# EAGLE design mqtt doorbell v1.2 (EAGLE 7.6.0)
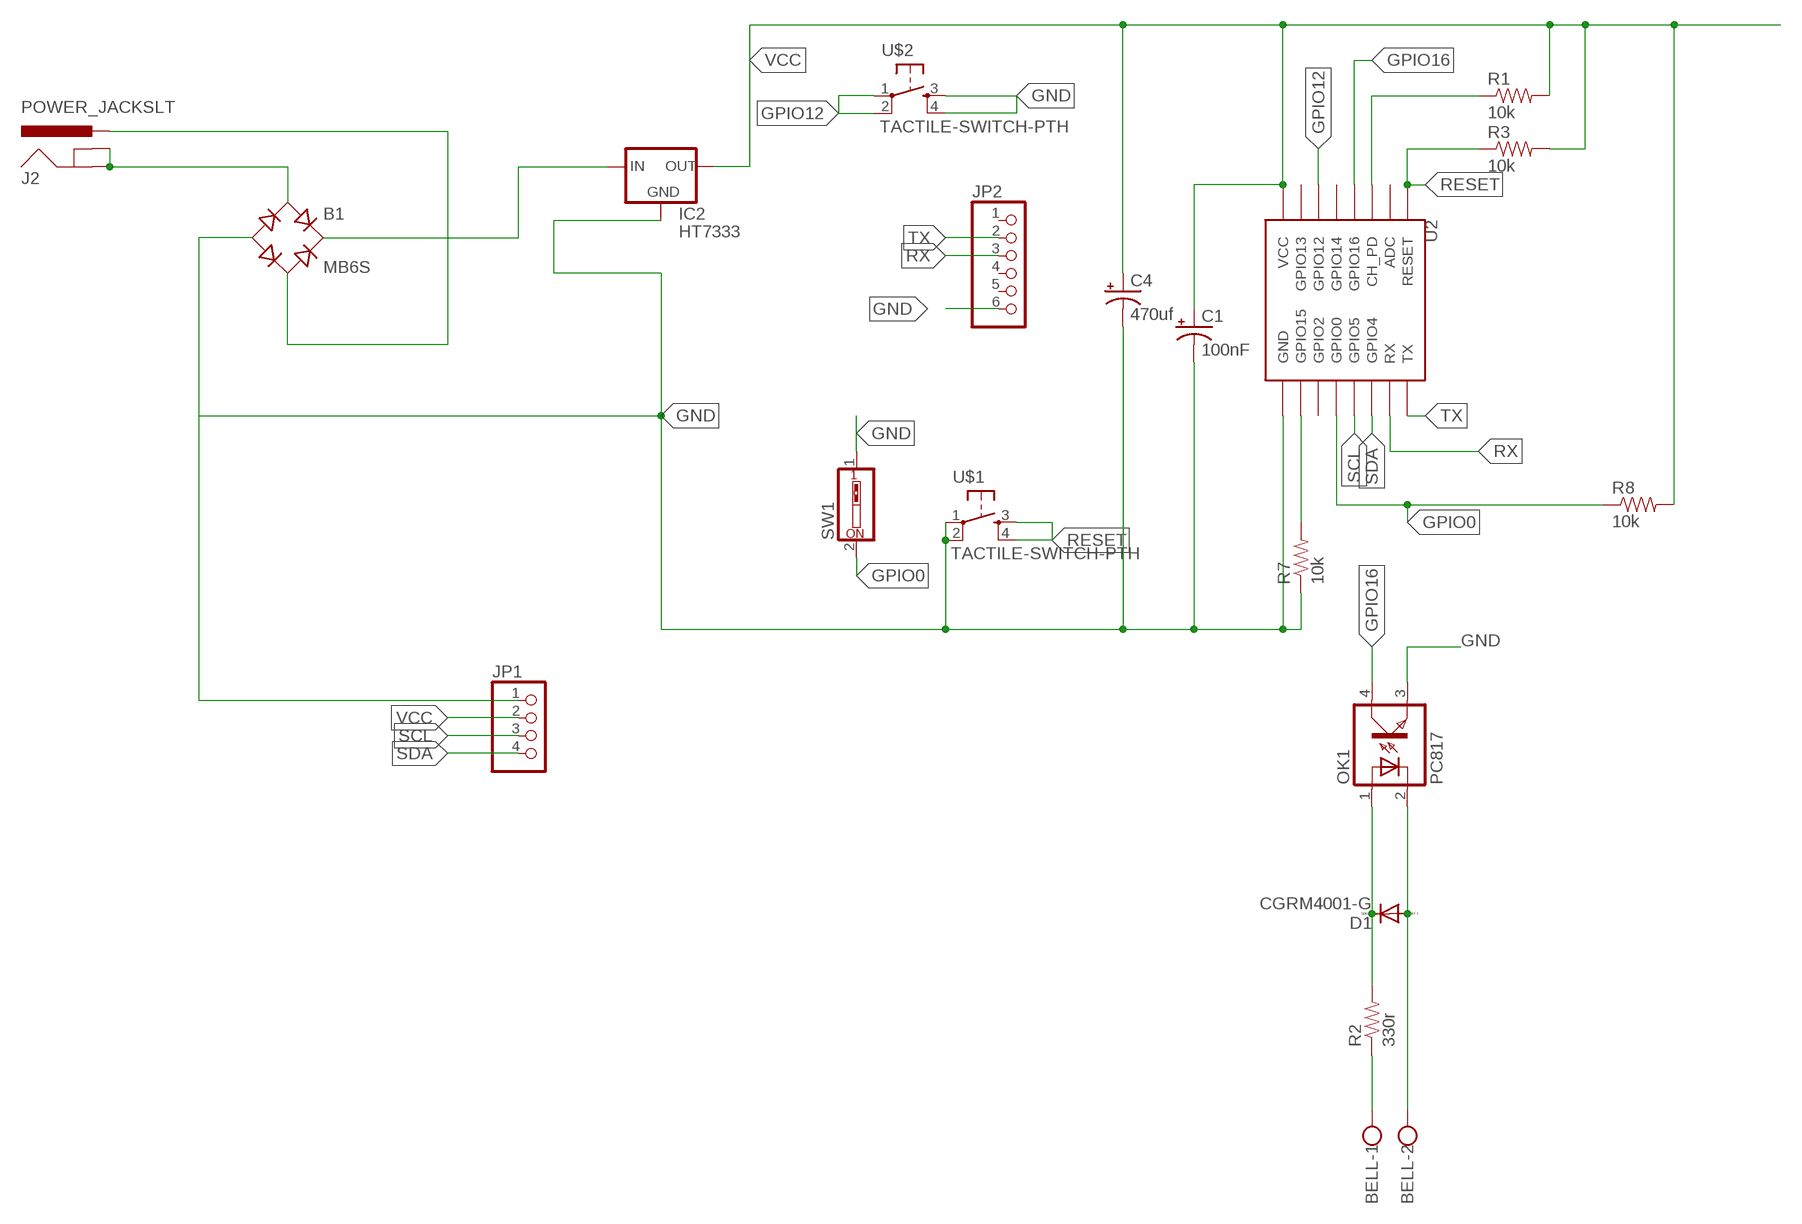
[diagram p0: schematic, sheet 1]

## Parts
B1  MB6S  MB4S  [SOIC-4]
BELL  W237-102  [W237-102]
C1  100nF  10UF-16V-10%(TANT)  [EIA3216]
C4  470uf  47UF-50V-20%(ELECT)  [PANASONIC_D]
D1  CGRM4001-G  [SOD-123_MINI-SMA]
IC2  HT7333  [SOT-89]
J2  POWER_JACKSLT  [POWER_JACK_SLOT]
JP1  PINHD-1X4  [1X04]
JP2  PINHD-1X6  [1X06]
OK1  PC817  [DIL04]
R1  10k  RESISTOR1206  [1206]
R2  330r  RESISTOR1206  [1206]
R3  10k  RESISTOR1206  [1206]
R7  10k  RESISTOR1206  [1206]
R8  10k  RESISTOR1206  [1206]
SW1  SW_DIP-1  [EDG-01]
U2  ESP12SMD  [ESP12-SMD]
U$1  TACTILE-SWITCH-PTH  [TAC-SWITCH-PTH]
U$2  TACTILE-SWITCH-PTH  [TAC-SWITCH-PTH]

## Nets
GND: B1.- C1.C(-) C4.- IC2.2(GND) JP1.1 JP2.6 OK1.3(EMIT) R7.1 SW1.1 U2.GND U$1.1 U$1.2 U$2.3 U$2.4
GPIO0: R8.1 SW1.2 U2.GPIO0
GPIO12: U2.GPIO12 U$2.1 U$2.2
GPIO16: OK1.4(COL) U2.GPIO16
N$1: B1.~2(AC2) J2.PWR
N$3: D1.C OK1.1(A) R2.2
N$4: BELL.2 D1.A OK1.2(C)
N$5: R1.1 U2.CH_PD
N$6: BELL.1 R2.1
N$7: R7.2 U2.GPIO15
N$9: B1.~1(AC1) J2.GND@1(GNDBREAK) J2.GND@2(GND)
N$10: B1.+ IC2.3(IN) IC2.4(IN)
RESET: R3.1 U2.RESET U$1.3 U$1.4
RX: JP2.3 U2.RXD0(RX)
SCL: JP1.3 U2.GPIO5
SDA: JP1.4 U2.GPIO4
TX: JP2.2 U2.TXD0(TX)
VCC: C1.A(+) C4.+ IC2.1(OUT) JP1.2 R1.2 R3.2 R8.2 U2.VCC
Unconnected: JP2.1 JP2.4 JP2.5 U2.ADC U2.GPIO2 U2.GPIO13 U2.GPIO14

## Library data of the parts
B1 = rectifier:MB*S: Bridge Rectifier Source: http://www.fairchildsemi.com/ds/MB/MB6S.pdf
BELL = con-wago-500:W237-102: WAGO SCREW CLAMP; MPN: 237-102; OC_FARNELL: unknown; OC_NEWARK: 70K9898
C1 = SparkFun-Capacitors:10UF-16V-10%(TANT): CAP-00811 1206/EIA-3216 Tantalum capacitor; PROD_ID: CAP-00811; VALUE: 10uF
C4 = SparkFun-Capacitors:47UF-50V-20%(ELECT): CAP-10547; PROD_ID: CAP-10547
D1 = diode:CGRM400*-G: Molded plasitc,JEDEC SOD-123/Mini SMA Source: Comchip CGRM4001-G.pdf
IC2 = Lemcke solutions:HT73*
J2 = Lemcke solutions:POWER_JACK: Power Jack Connector This is the standard 5.5mm barrel jack for power. The PTH is the most common, proven, reliable, footprint. The Slot footprint only works if the mill layer is transmitted to the PCB fab house so be warned. Here are the connectors we sell at SparkFun: DC Barrel Power Jack/Connector <https://www.sparkfun.com/products/119> (PRT-00119) DC Barrel Power Jack/Connector (SMD) <https://www.sparkfun.com/products/12748> (PRT-12748) DC Barrel Jack Adapter - Breadboard Compatible <https://www.sparkfun.com/products/10811> (PRT-10811) It is used on this SparkFun product (and many, many others): SparkFun RedBoard - Programmed with Arduino <https://www.sparkfun.com/products/12757> (DEV-12757) Also, if you need a mating power supply or connector, please check these out: Wall Adapter Power Supply - 9VDC 650mA <https://www.sparkfun.com/products/298> (TOL-00298) DC Barrel Jack Adapter - Male <https://www.sparkfun.com/products/10287> (PRT-10287); PROD_ID: PRT-00119
JP1 = pinhead:PINHD-1X4: PIN HEADER
JP2 = pinhead:PINHD-1X6: PIN HEADER
OK1 = optocoupler:PC817: SHARP OPTO COUPLER; MPN: PC817X4J000F; OC_FARNELL: 9707727; OC_NEWARK: 97K7059
R1-R3 R7 R8 = SparkFun-Passives:RESISTOR: Resistor Basic schematic elements and footprints for 0603, 1206, and PTH resistors.
SW1 = special:SW_DIP-1: DIP SWITCH
U2 = esp8266modules:ESP12: ESP8266 Wifi module 12
U$1 U$2 = GeekAmmo:TACTILE-SWITCH: Tactile Switch 4 Pins, SPST NO

## Net classes
0 default: width 0.203 mm, clearance 0.205 mm

## Board
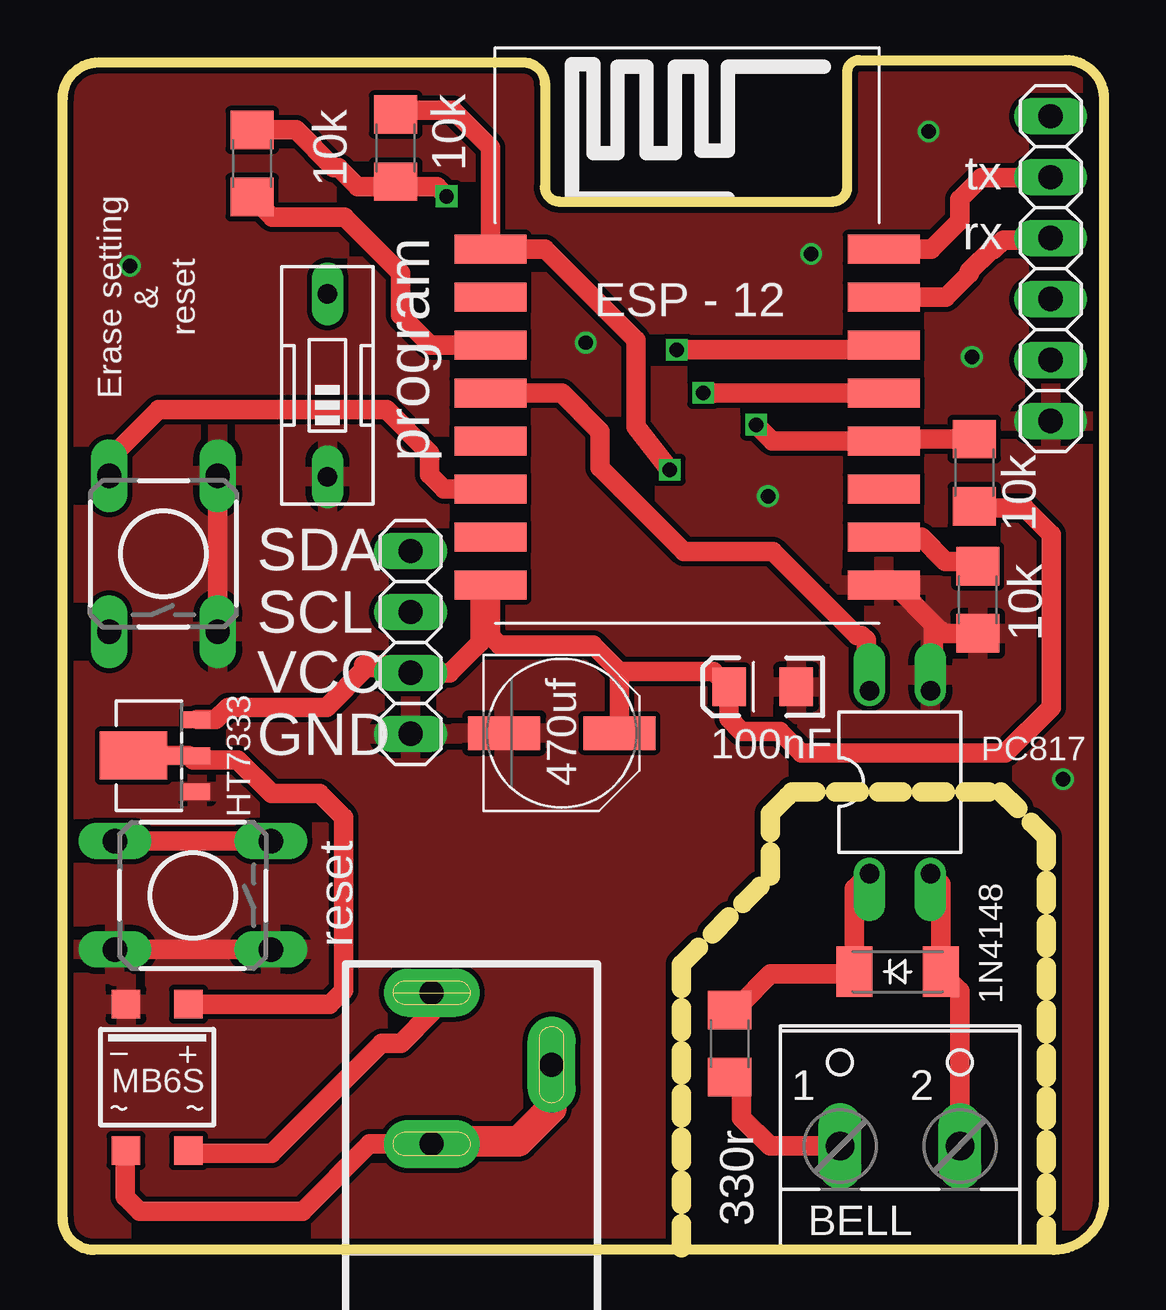
[diagram p1: board, top side]
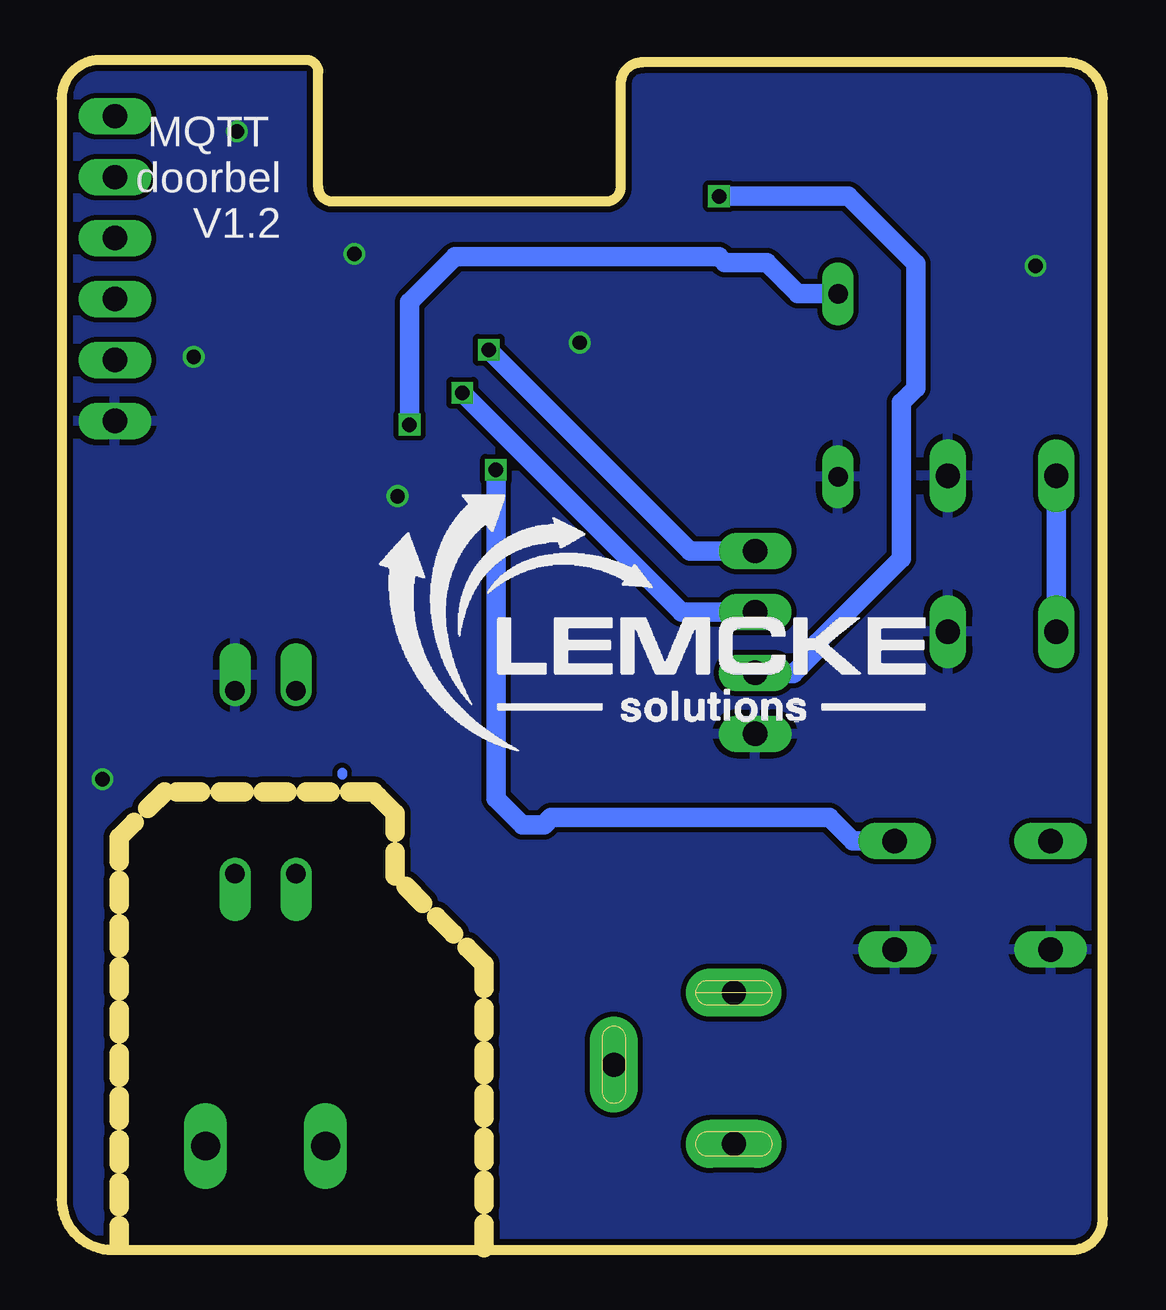
[diagram p2: board, bottom side, seen from below]

Size 43.4 x 49.6 mm. Coordinates in mm from the lower left corner, seen from the top.
Outline: 25.8,0.1 25.8,11.9 29.5,15.6 29.5,18.2 30.4,19.1 39.1,19.1 41,17.2 41,0.3
Outline: 1.5,49.5 arc90 0,48 0,1.3 arc90 1.3,0 41.3,0 arc90 43.4,2.1 43.4,48 arc90 41.8,49.6 33.2,49.6 arc90 32.7,49.1 32.7,44.3 arc-90 32.1,43.7 20.7,43.7 arc-90 20.1,44.3 20.1,48.6 arc90 19.2,49.5
Outline: 1.5,49.5 19.2,49.5
Outline: 1.5,49.5 19.2,49.5
Outline: 1.5,49.5 19.2,49.5
Copper layers (1*16): Top 0.035mm / dielectric 1.5mm / Bottom 0.035mm
Design rules "SeeedStudio_2layer_DRU_no_angle_20140221": minimum track width 6mil, minimum drill 12mil, track to track 6mil, track to pad 6mil, pad to pad 6mil, via to via 6mil, smd to smd 0mil, copper to edge 10mil, drill to drill 10mil, minimum pad ring 10mil, minimum via ring 6mil, stop-mask expansion 2mil, vias tented up to drill 100mil, thermal gap 10mil

### Footprints (pad centres in the part's own frame; a part is rotated, then mirrored left to right if it is on the bottom)
SOIC-4 = smd 1.2 x 1.2: + 1.3,3.05; - -1.3,3.05; ~1 -1.3,-3.05; ~2 1.3,-3.05
W237-102 = drill 1.194 long: 1 -2.5,-1.27; 2 2.5,-1.27
EIA3216 = smd 1.4 x 1.6: A 1.4,0; C -1.4,0
PANASONIC_D = smd 3 x 1.4: + 2.4,0; - -2.4,0
SOD-123_MINI-SMA = smd 1.5 x 2.1: A 1.8,0; C -1.8,0
SOT-89 = smd 0.7 x 1.1: 1 1.5,-2.385; 2 -1.5,-2.385 | smd 0.7 x 1.8: 3 0,-2.035 | smd 2 x 2.8: 4 0,0.265 | smd 0.635 x 1.27: P$1 0,-2.3; P$2 0,-1.6; P$3 0,-0.8; P$4 0,-0.2; P$5 0,0.3; P$6 -0.1,0.9
POWER_JACK_SLOT = drill 1 pad 2 long: GND@1 2.58,7.5; GND@2 7.58,10.8; PWR 2.58,13.8
1X04 = drill 1.016 long: 1 -3.81,0; 2 -1.27,0; 3 1.27,0; 4 3.81,0
1X06 = drill 1.016 long: 1 -6.35,0; 2 -3.81,0; 3 -1.27,0; 4 1.27,0; 5 3.81,0; 6 6.35,0
DIL04 = drill 0.813 offset: 1 -1.27,-3.81; 2 1.27,-3.81; 3 1.27,3.81; 4 -1.27,3.81
1206 = smd 1.6 x 1.8: 1 -1.4,0; 2 1.4,0
EDG-01 = drill 0.813 long: 1 0,-3.81; 2 0,3.81
ESP12-SMD = smd 3 x 1.2: ADC -8.3,3.8; CH_PD -8.3,1.8; GND 8.1,-8.2; GPIO0 8.1,-2.2; GPIO2 8.1,-4.2; GPIO4 8.1,1.8; GPIO5 8.1,-0.2; GPIO12 -8.3,-4.2; GPIO13 -8.3,-6.2; GPIO14 -8.3,-2.2; GPIO15 8.1,-6.2; GPIO16 -8.3,-0.2; RESET -8.3,5.8; RXD0 8.1,3.8; TXD0 8.1,5.8; VCC -8.3,-8.2
TAC-SWITCH-PTH = drill 1.016 pad 1.524 long: 1 -3.251,2.261; 2 3.251,2.261; 3 -3.251,-2.261; 4 3.251,-2.261

### Placement (x,y rotation side)
B1  3.94,7.19 0 top
BELL  34.9,5.6 0 top
C1  29.17,23.47 180 top
C4  20.8,21.54 0 top
D1  34.8,11.6 0 top
IC2  3.21,20.6 90 top
J2  12.8,-3.08 0 top
JP1  14.5,25.32 90 top
JP2  41.18,40.91 270 top
OK1  34.9,19.5 0 top
R1  7.9,45.28 90 top
R2  27.8,8.6 90 top
R3  13.87,45.93 270 top
R7  38.14,27.1 90 top
R8  38,32.4 270 top
SW1  11.04,36.04 0 top
U2  26.12,35.91 0 top
U$1  5.42,14.78 180 top
U$2  4.2,29.02 90 top

### Tracks (layer width: path | path; a pad name or v marks a point on that pad's centre or on a via)
GND  (via drill 0.6)
  Top 0.813: U2.GND 34.69,27.71 36.3,26.1 | 36.3,26.1 36.3,23.44 OK1.3 | R7.1 36.7,25.7 36.3,26.1 | U$1.2 U$1.1 | U$2.3 U$2.4
  other vias: 37.9,37.22 29.4,31.42 2.8,41.02 41.7,19.62 36.1,46.62 31.2,41.52 21.8,37.82
  pour Bottom: -0.3,49.4 41.51,49.47 43.1,49.2 43,0.5 41.2,0.4 41,0.7 41,17.1 38.8,19.3 31.3,19.3 26.5,12.8 25.9,1.3 25.3,0.1 7.4,0.2 -0.5,-0.3 -8.6,35.1 -0.9,38.3
  pour Top: -0.7,59.42 49.3,59.42 49.3,-10.58 -0.7,-10.58
GPIO0  (via drill 0.6)
  Top 0.813: R8.1 34.31,33.8 U2.GPIO0 29.59,33.71 v28.9,34.4
  Bottom 0.813: v28.9,34.4 28.9,39.5 27,41.4 16,41.4 15.75,41.15 14.01,41.15 12.71,39.85 SW1.2
GPIO12
  Top 0.813: U$2.2 1.94,32.96 4,35.02 13.5,35.02 15.3,33.22 15.3,32.32 15.9,31.72 U2.GPIO12
  Bottom 0.813: U$2.2 U$2.1
GPIO16
  Top 0.813: U2.GPIO16 20.81,35.71 22.4,34.12 22.4,32.62 25.9,29.12 29.6,29.12 33.1,25.62 33.3,25.62 33.5,25.42 33.5,23.44 OK1.4
N$1
  Top 0.813: J2.PWR 15.38,9.9 14.1,8.62 13.3,8.62 8.7,4.02 5.36,4.02 B1.~2
N$3
  Top 0.813: OK1.1 33,15.06 D1.C 32.9,11.5 29.5,11.5 28.2,10.2 R2.2
N$4
  Top 0.813: BELL.2 37.4,10.8 D1.A 36.6,15.26 OK1.2
N$5
  Top 0.813: U2.CH_PD 17.81,37.72 15.33,37.72 14.09,38.97 14.09,40.72 11.75,43.06 8.72,43.06 R1.1
N$6
  Top 0.813: BELL.1 29.47,4.33 28.3,5.5 28.3,7.1 R2.1
N$7
  Top 0.813: U2.GPIO15 35.79,29.71 36.8,28.7 37.94,28.7 R7.2
N$8
  Bottom 0.406: 31.7,19.9 31.7,19.8
N$9
  Top 0.813: J2.GND@1 12.8,4.42 10,1.62 3.2,1.62 2.6,2.22 2.6,4.11 B1.~1
  Top 1.27: J2.GND@2 20.38,5.9 19,4.52 15.48,4.52 J2.GND@1
N$10
  Top 0.813: IC2.4 IC2.3 5.43,20.42 7.3,20.42 8.7,19.02 10.7,19.02 11.7,18.02 11.7,10.82 11.12,10.24 B1.+
RESET  (via drill 0.6)
  Top 0.813: U$1.4 U$1.3 | R3.1 14.05,47.5 16.27,47.5 17.82,45.95 U2.RESET 20.11,41.71 23.9,37.92 23.9,34.32 v25.3,32.52
  Bottom 0.813: v25.3,32.52 25.3,18.82 24.2,17.72 23.29,17.72 22.99,18.02 11.4,18.02 10.42,17.04 U$1.3
RX
  Top 0.813: U2.RXD0 36.81,39.71 37.8,40.7 37.8,40.8 38.7,41.7 38.8,41.7 39.2,42.1 41.11,42.1 JP2.3
SCL  (via drill 0.6)
  Top 0.813: v26.7,35.72 U2.GPIO5
  Bottom 0.813: JP1.3 17.57,26.59 v26.7,35.72
SDA  (via drill 0.6)
  Top 0.813: v25.6,37.52 34.03,37.52 U2.GPIO4
  Bottom 0.813: JP1.4 17.21,29.13 v25.6,37.52
TX
  Top 0.813: U2.TXD0 36.21,41.71 37.4,42.9 37.4,43.8 38.3,44.7 41.17,44.7 JP2.2
VCC  (via drill 0.6)
  Top 0.813: JP1.2 16.13,24.05 17.4,25.32 17.4,27.29 U2.VCC 17.82,25.6 18.2,25.22 22.1,25.22 23.2,24.12 | 23.2,24.12 23.2,22.54 C4.+ | 14.57,24.02 JP1.2 | R1.2 9.73,46.68 11.3,45.12 11.5,45.12 12.3,44.32 13.66,44.32 | 13.66,44.32 R3.2 | 13.66,44.32 15.6,44.32 v16,43.92 | 12.55,24.37 14.28,24.37 JP1.2 | IC2.1 6.38,22.1 6.9,22.62 11,22.62 12.65,24.27 14.38,24.27 JP1.2 | 23.2,24.12 27.13,24.12 C1.A 27.77,22.15 28.3,21.62 29.9,21.62 30.8,20.72 39.3,20.72 41.2,22.62 41.2,29.82 40.1,30.92 38.08,30.92 R8.2
  Bottom 0.813: v16,43.92 10.6,43.92 7.8,41.12 7.8,35.92 8.4,35.32 8.4,28.82 11.9,25.32 11.9,25.02 12.9,24.02 14.57,24.02 JP1.2

### Text on the board
tPlace: 10k | 10k | tx | program | rx | Erase setting / & / reset | 10k | SDA | SCL | 10k | VCC | GND | reset | 1N4148
bPlace: MQTT / doorbel / V1.2